# EAGLE board dw8e (EAGLE 6.6.0)
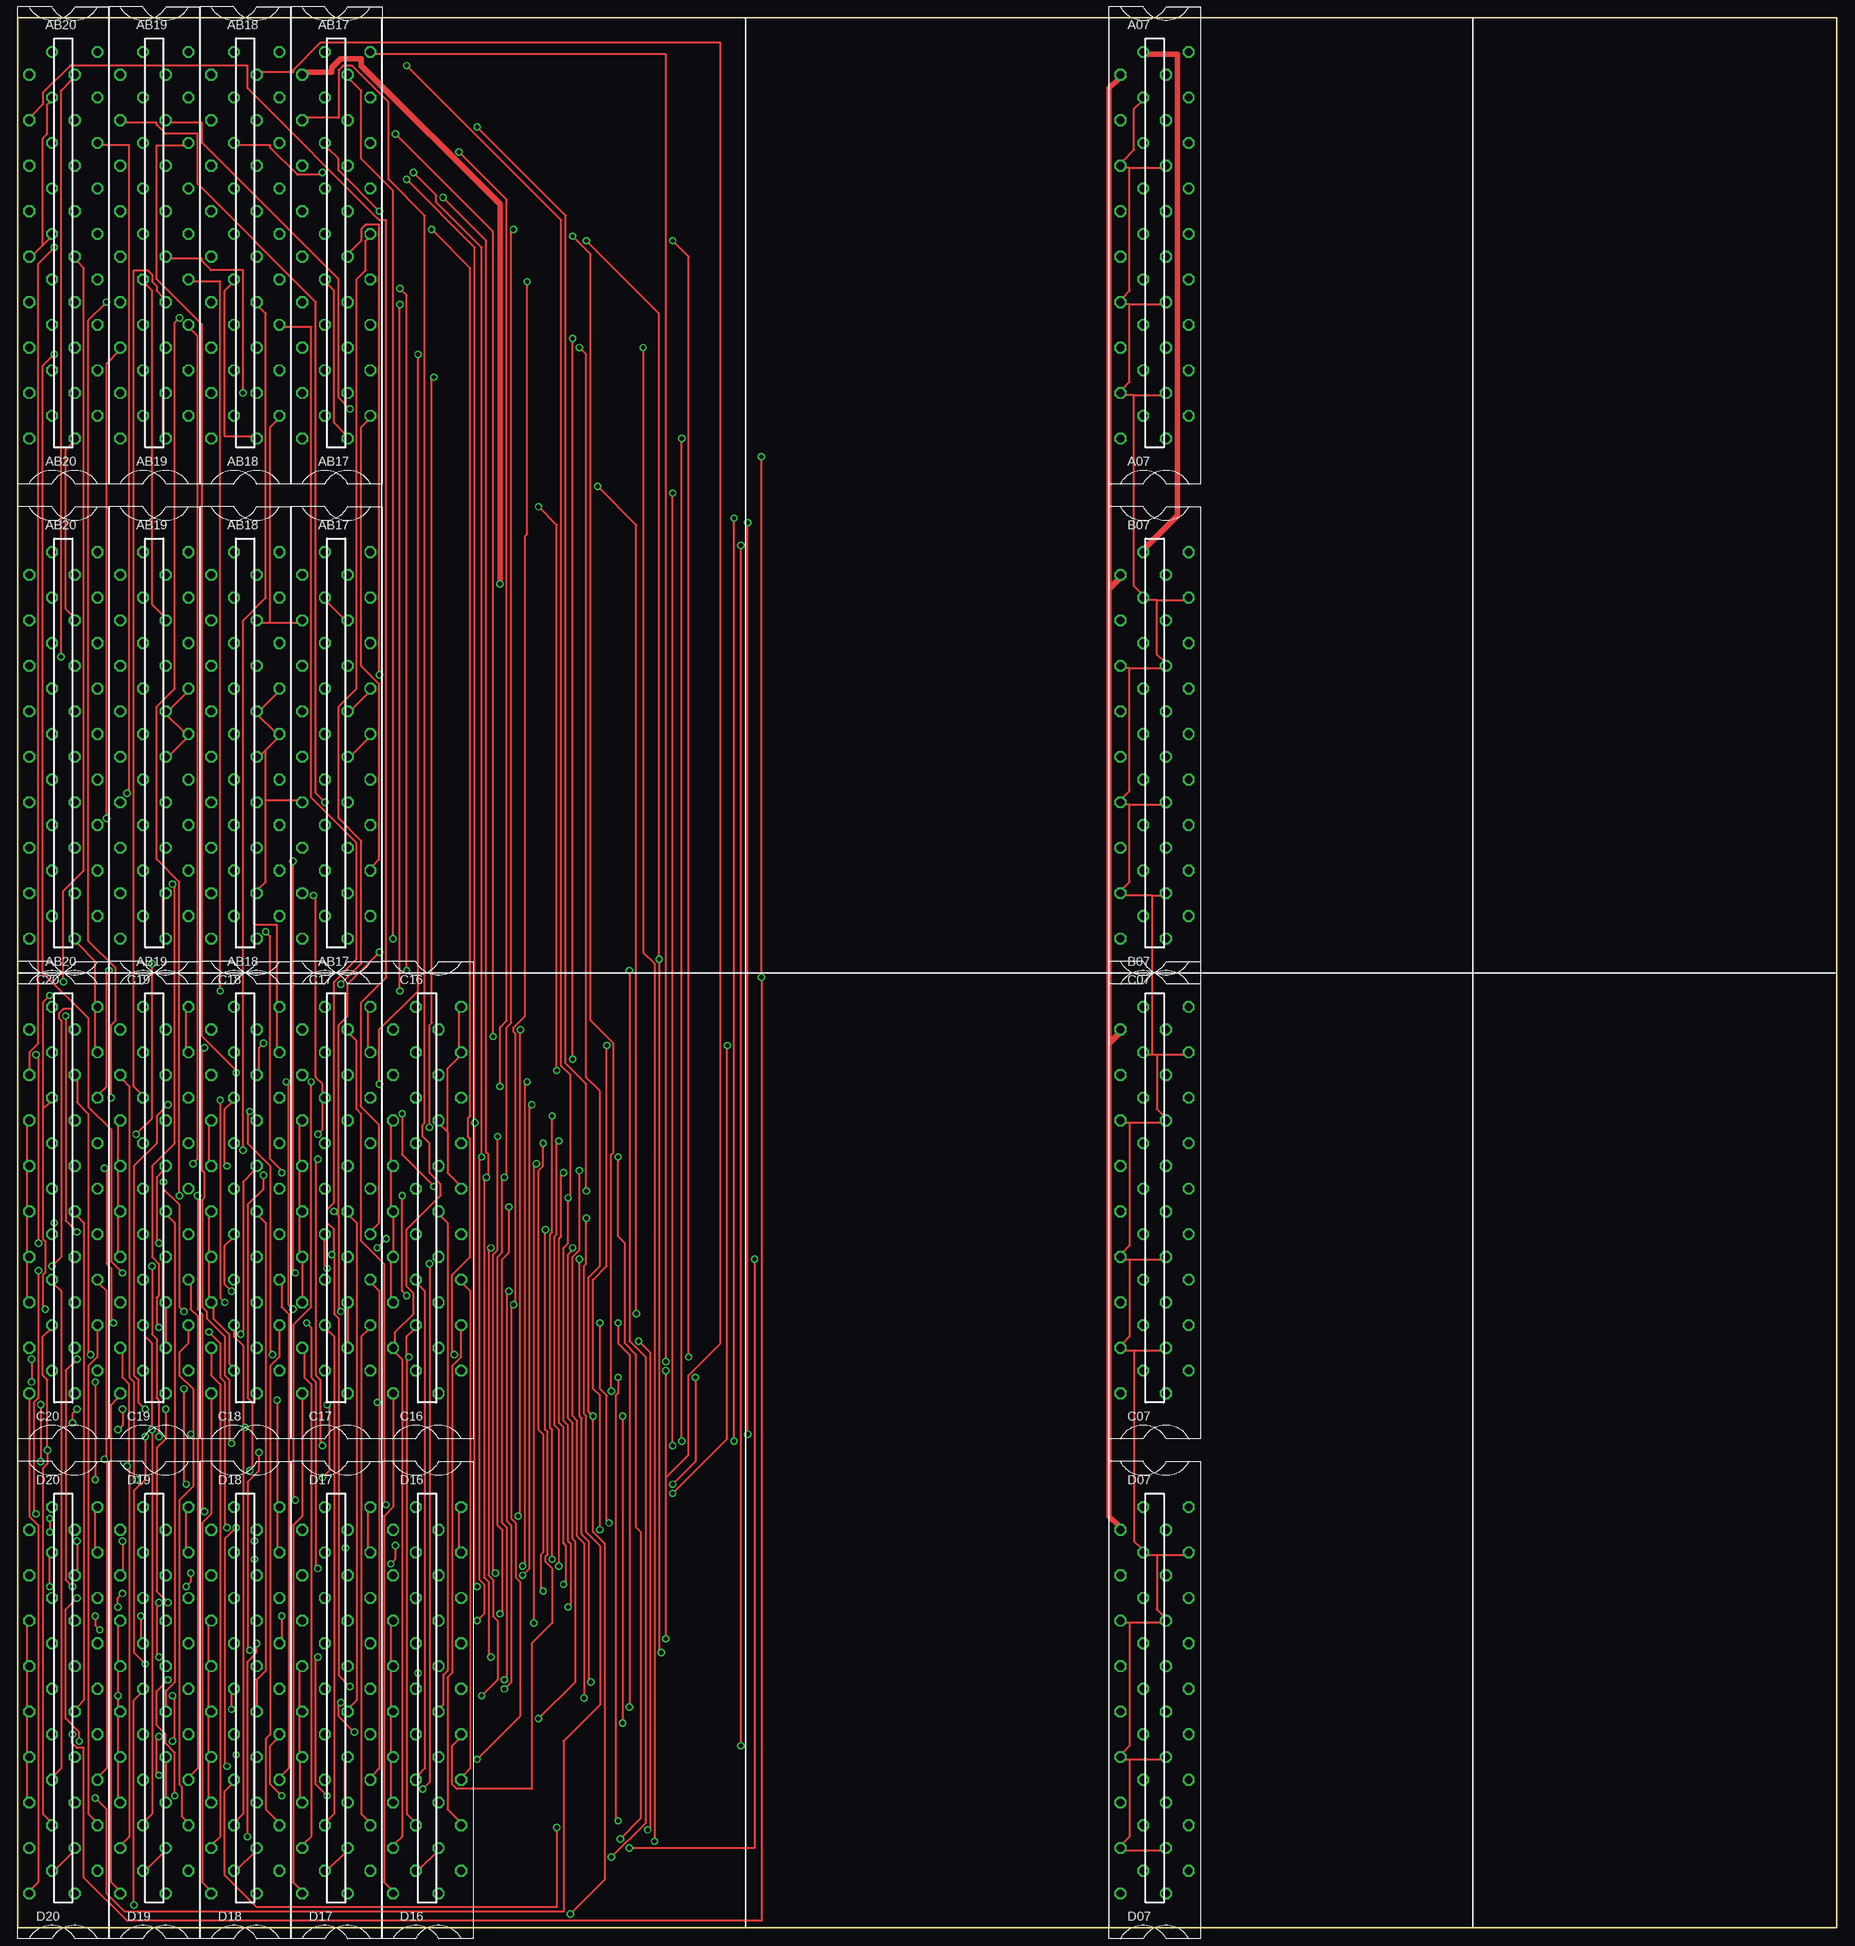
[diagram p10: board, top side]
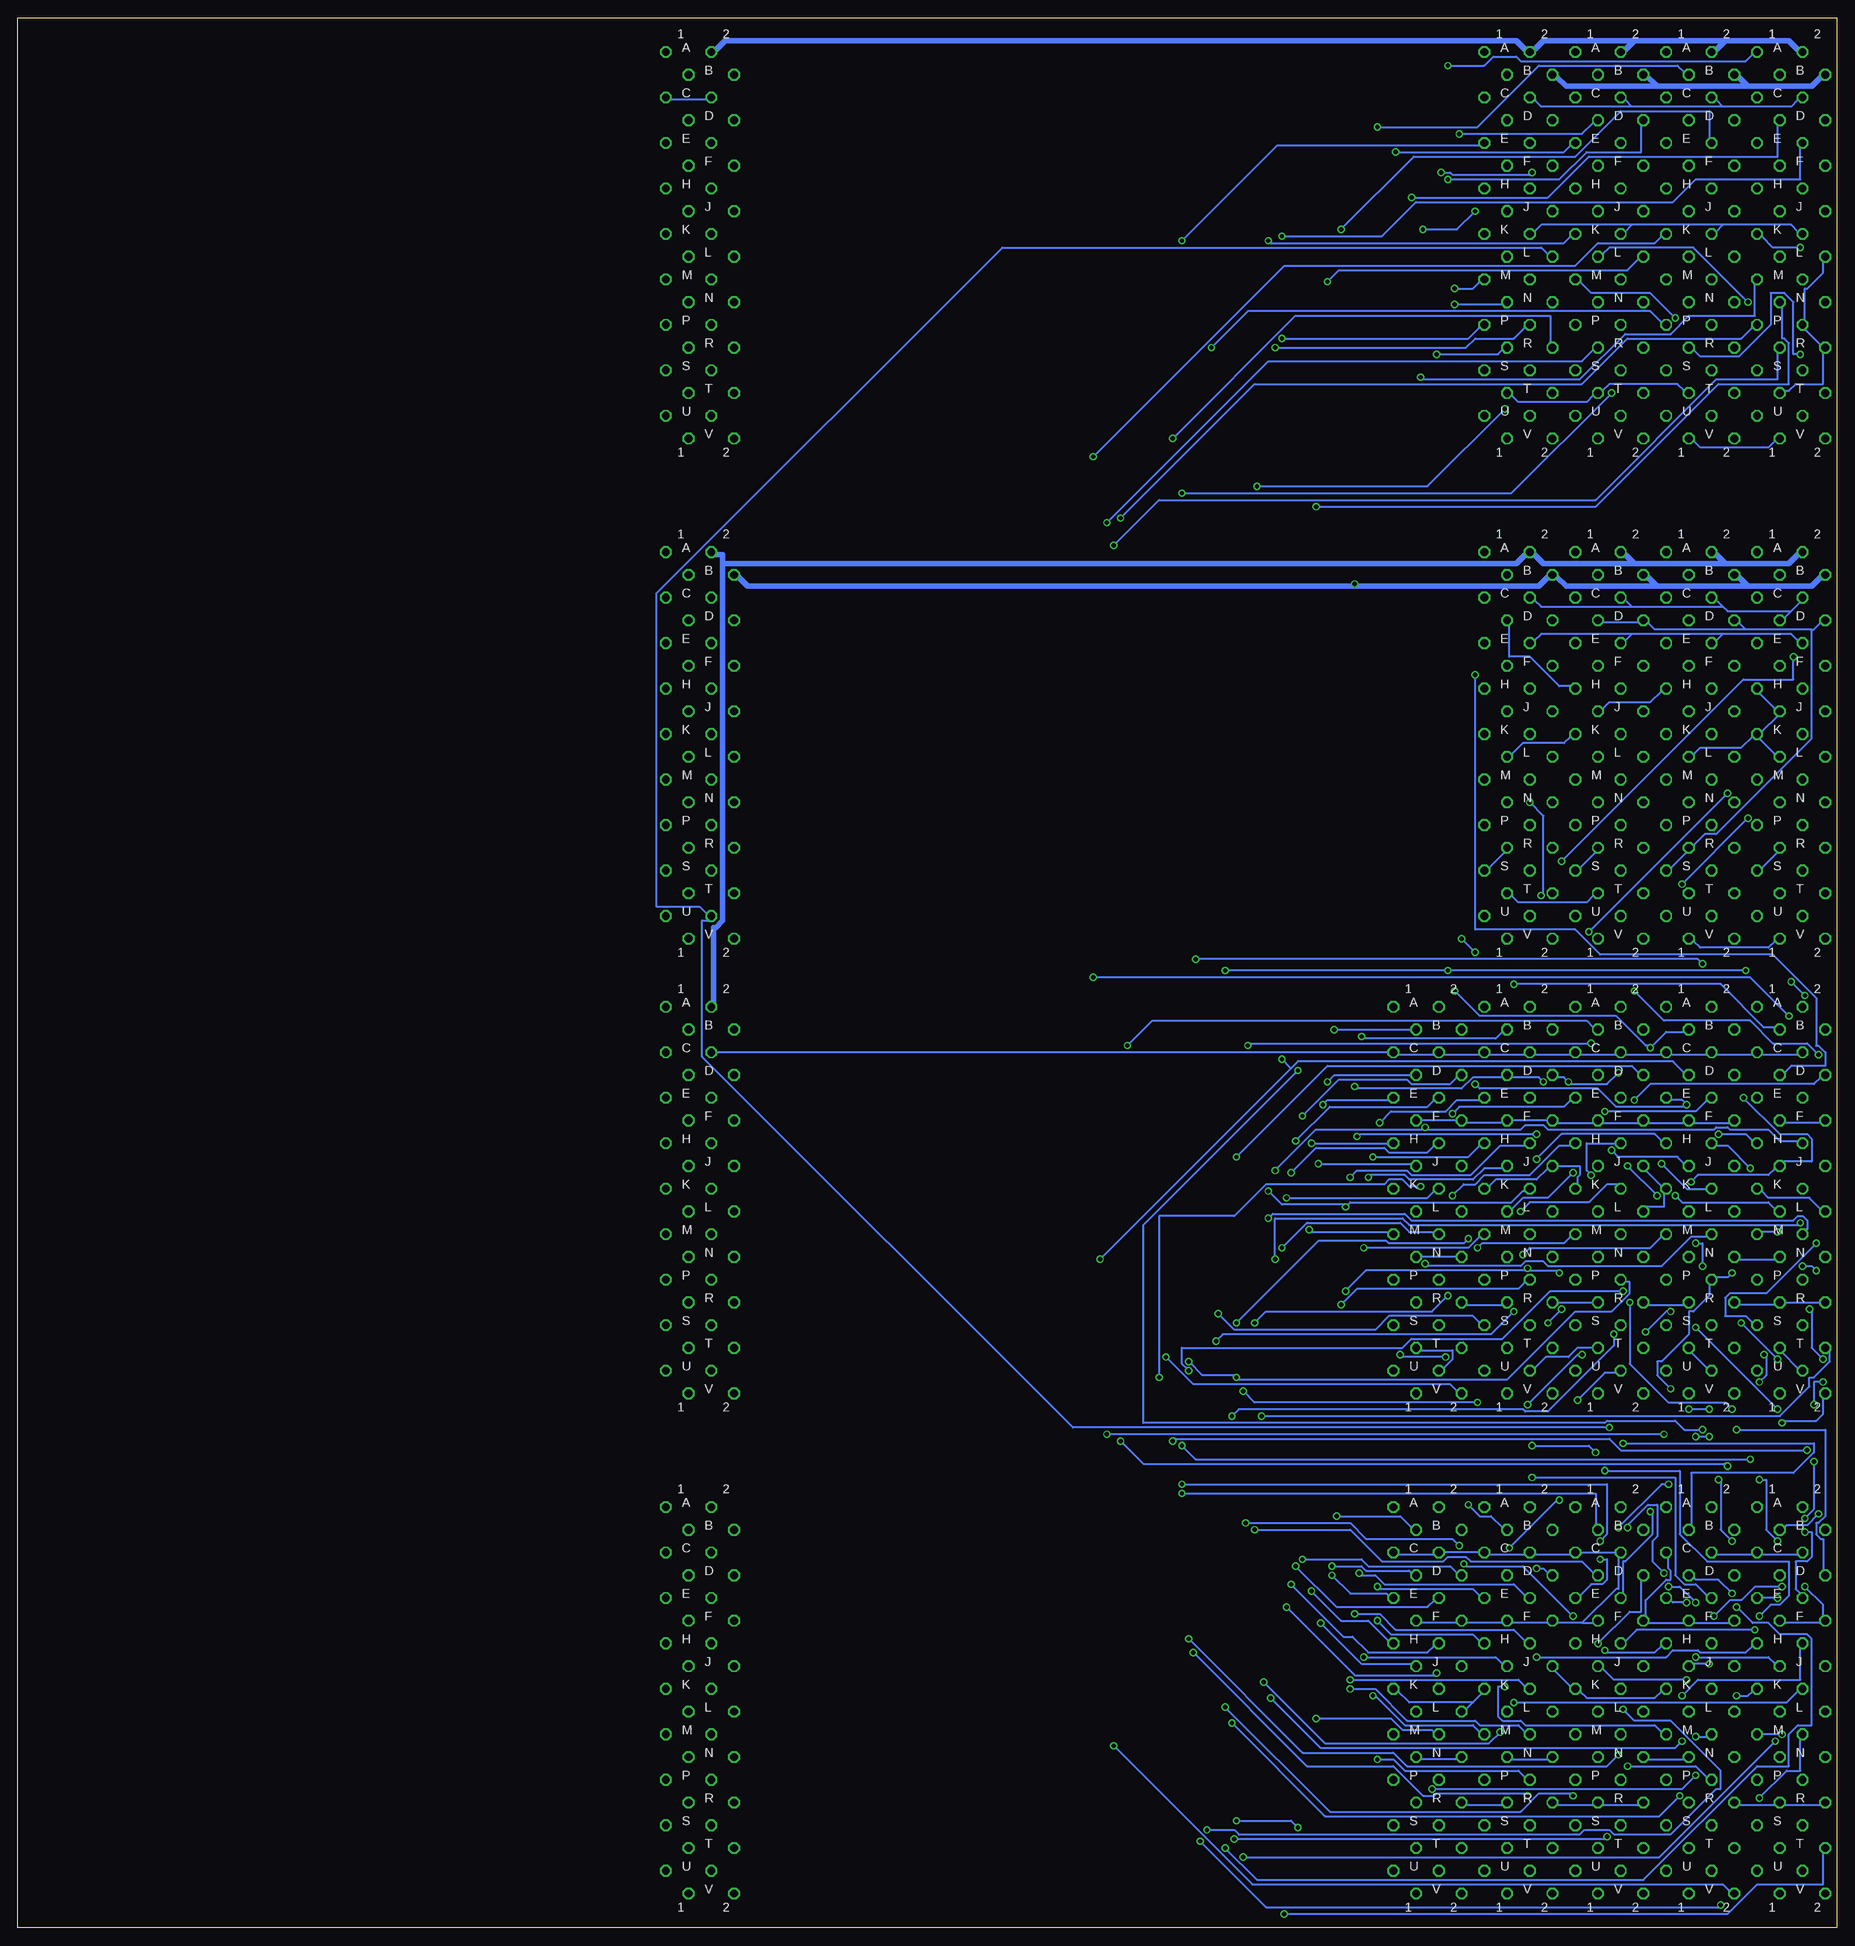
[diagram p11: board, bottom side, seen from below]

Size 254 x 266.7 mm. Coordinates in mm from the lower left corner, seen from the top.
Outline: 0,0 254,0 254,266.7 0,266.7 0,0
Copper layers (1*16): Top 0.035mm / dielectric 1.5mm / Bottom 0.035mm
Design rules "default": minimum track width 10mil, minimum drill 24mil, track to track 8mil, track to pad 8mil, pad to pad 8mil, via to via 8mil, smd to smd 8mil, copper to edge 25mil, drill to drill 8mil, minimum pad ring 10mil, minimum via ring 8mil, stop-mask expansion 4mil, vias tented up to drill 0mil, thermal gap 10mil
Net classes: 1 Supply: width 0.762 mm

## Footprints (pad centres in the part's own frame; a part is rotated, then mirrored left to right if it is on the bottom)
H807 = drill 1.092 octagon: A1 4.763,28.575; A2 -1.587,28.575; B1 1.587,25.4; B2 -4.763,25.4; C1 4.763,22.225; C2 -1.587,22.225; D1 1.587,19.05; D2 -4.763,19.05; E1 4.763,15.875; E2 -1.587,15.875; F1 1.587,12.7; F2 -4.763,12.7; H1 4.763,9.525; H2 -1.587,9.525; J1 1.587,6.35; J2 -4.763,6.35; K1 4.763,3.175; K2 -1.587,3.175; L1 1.587,0; L2 -4.763,0; M1 4.763,-3.175; M2 -1.587,-3.175; N1 1.587,-6.35; N2 -4.763,-6.35; P1 4.763,-9.525; P2 -1.587,-9.525; R1 1.587,-12.7; R2 -4.763,-12.7; S1 4.763,-15.875; S2 -1.587,-15.875; T1 1.587,-19.05; T2 -4.763,-19.05; U1 4.763,-22.225; U2 -1.587,-22.225; V1 1.587,-25.4; V2 -4.763,-25.4
H807-2 = drill 1.092 octagon: AA1 4.763,60.325; AA2 -1.587,60.325; AB1 1.587,57.15; AB2 -4.763,57.15; AC1 4.763,53.975; AC2 -1.587,53.975; AD1 1.587,50.8; AD2 -4.763,50.8; AE1 4.763,47.625; AE2 -1.587,47.625; AF1 1.587,44.45; AF2 -4.763,44.45; AH1 4.763,41.275; AH2 -1.587,41.275; AJ1 1.587,38.1; AJ2 -4.763,38.1; AK1 4.763,34.925; AK2 -1.587,34.925; AL1 1.587,31.75; AL2 -4.763,31.75; AM1 4.763,28.575; AM2 -1.587,28.575; AN1 1.587,25.4; AN2 -4.763,25.4; AP1 4.763,22.225; AP2 -1.587,22.225; AR1 1.587,19.05; AR2 -4.763,19.05; AS1 4.763,15.875; AS2 -1.587,15.875; AT1 1.587,12.7; AT2 -4.763,12.7; AU1 4.763,9.525; AU2 -1.587,9.525; AV1 1.587,6.35; AV2 -4.763,6.35; BA1 4.763,-9.525; BA2 -1.587,-9.525; BB1 1.587,-12.7; BB2 -4.763,-12.7; BC1 4.763,-15.875; BC2 -1.587,-15.875; BD1 1.587,-19.05; BD2 -4.763,-19.05; BE1 4.763,-22.225; BE2 -1.587,-22.225; BF1 1.587,-25.4; BF2 -4.763,-25.4; BH1 4.763,-28.575; BH2 -1.587,-28.575; BJ1 1.587,-31.75; BJ2 -4.763,-31.75; BK1 4.763,-34.925; BK2 -1.587,-34.925; BL1 1.587,-38.1; BL2 -4.763,-38.1; BM1 4.763,-41.275; BM2 -1.587,-41.275; BN1 1.587,-44.45; BN2 -4.763,-44.45; BP1 4.763,-47.625; BP2 -1.587,-47.625; BR1 1.587,-50.8; BR2 -4.763,-50.8; BS1 4.763,-53.975; BS2 -1.587,-53.975; BT1 1.587,-57.15; BT2 -4.763,-57.15; BU1 4.763,-60.325; BU2 -1.587,-60.325; BV1 1.587,-63.5; BV2 -4.763,-63.5

## Placement (x,y rotation side)
A07  M916  [H807]  158.75,233.36 0 top
AB17  M7102  [H807-2]  44.45,201.61 0 top
AB18  M7102  [H807-2]  31.75,201.61 0 top
AB19  M7102  [H807-2]  19.05,201.61 0 top
AB20  M7102  [H807-2]  6.35,201.61 0 top
B07  M916  [H807]  158.75,163.51 0 top
C07  M916  [H807]  158.75,100.01 0 top
C16  M903  [H807]  57.15,100.01 0 top
C17  M903  [H807]  44.45,100.01 0 top
C18  M903  [H807]  31.75,100.01 0 top
C19  M903  [H807]  19.05,100.01 0 top
C20  M903  [H807]  6.35,100.01 0 top
D07  M916  [H807]  158.75,30.16 0 top
D16  M903  [H807]  57.15,30.16 0 top
D17  M903  [H807]  44.45,30.16 0 top
D18  M903  [H807]  31.75,30.16 0 top
D19  M903  [H807]  19.05,30.16 0 top
D20  M903  [H807]  6.35,30.16 0 top
U$1  [CBLOCK]  152.4,133.35 0 top
U$2  [CBLOCK]  101.6,133.35 0 top
U$3  [CBLOCK]  50.8,133.35 0 top
U$4  [CBLOCK]  0,133.35 0 top
U$6  [CBLOCK]  0,0 0 top
U$7  [CBLOCK]  50.8,0 0 top
U$8  [CBLOCK]  101.6,0 0 top
U$9  [CBLOCK]  152.4,0 0 top
U$10  [CBLOCK]  203.2,0 0 top
U$11  [CBLOCK]  203.2,0 0 top
U$12  [CBLOCK]  203.2,133.35 0 top

## Tracks (layer width: path | path; a pad name or v marks a point on that pad's centre or on a via)
-15V  (via drill 0.61)
  Top 0.762: 152.4,123.51 152.4,57.47 153.67,56.2 D07.B2 | 152.4,123.51 153.67,124.78 C07.B2 | 152.56,187.17 152.4,187.01 152.4,123.82 152.4,123.51 | 152.56,187.17 153.67,188.28 B07.B2 | A07.B2 153.67,258.13 152.4,256.86 152.4,187.32 152.56,187.17 | v67.31,187.64 67.31,240.66 47.94,260.03 47.94,260.99 45.09,260.99 43.81,259.71 43.81,259.08 40.32,259.08 AB17.AB2
  Bottom 0.762: 12.38,257.18 3.49,257.18 2.22,258.44 AB20.AB2 | 12.38,257.18 13.65,258.44 AB19.AB2 | 25.24,257.33 25.08,257.18 12.7,257.18 12.38,257.18 | 25.24,257.33 26.35,258.44 AB18.AB2 | AB17.AB2 39.05,258.44 37.78,257.18 25.4,257.18 25.24,257.33 | 12.38,187.32 3.49,187.32 2.22,188.59 AB20.BB2 | 12.38,187.32 13.65,188.59 AB19.BB2 | 25.24,187.48 25.08,187.32 12.7,187.32 12.38,187.32 | 25.24,187.48 26.35,188.59 AB18.BB2 | 25.24,187.48 25.4,187.32 37.78,187.32 39.05,188.59 AB17.BB2 40.32,188.59 41.59,187.32 67.31,187.32 | 67.31,187.32 152.08,187.32 153.35,188.59 B07.B2 | 67.31,187.32 v67.31,187.64
AC_00_BUS_L  (via drill 0.61)
  Top 0.254: v91.44,60.64 99.06,68.26 v99.06,123.19
  Bottom 0.254: v91.44,60.64 33.66,60.64 33.66,56.2 D18.B1 | v99.06,123.19 95.57,126.68 34.92,126.68 33.97,125.73 C18.B1
AC_01_BUS_L  (via drill 0.61)
  Top 0.254: v81.28,55.56 81.28,74.29 80.33,75.25 80.33,90.49 82.23,92.39 v82.23,123.19 | v34.29,123.51 33.66,122.87 33.66,119.7 C18.D1
  Bottom 0.254: v81.28,55.56 67.94,55.56 63.5,51.12 54.93,51.12 54.29,51.75 51.75,51.75 51.12,51.12 35.56,51.12 33.97,49.53 D18.D1 | v82.23,123.19 81.92,123.51 v34.29,123.51
AC_02_BUS_L  (via drill 0.61)
  Top 0.254: v33.02,53.97 v33.02,51.43 | v91.44,61.91 94.61,65.09 v94.61,76.83 | v58.1,103.5 53.66,107.95 v53.66,113.66
  Bottom 0.254: v33.02,51.43 32.07,51.43 32.07,48.58 32.7,47.94 34.29,47.94 35.88,46.35 D18.E1 | v33.02,53.97 32.07,54.93 32.07,61.91 v91.44,61.91 | v94.61,76.83 94.61,99.38 84.14,99.38 79.69,103.82 63.18,103.82 62.55,104.46 60.64,104.46 59.69,103.5 v58.1,103.5 | v53.66,113.66 52.7,114.62 38.1,114.62 37.15,115.57 C18.E1
AC_03_BUS_L  (via drill 0.61)
  Top 0.254: v36.83,43.5 36.83,40.32 D18.H1 | v52.07,50.8 52.7,51.43 v52.7,53.34 | v82.55,56.52 82.23,56.83 82.23,74.29 81.28,75.25 v81.28,84.45 | v54.29,88.26 53.66,88.9 v53.66,102.23
  Bottom 0.254: v36.83,43.5 43.81,50.48 51.75,50.48 v52.07,50.8 | v52.7,53.34 53.66,54.29 65.72,54.29 67.94,56.52 v82.55,56.52 | v81.28,84.45 79.69,86.04 56.52,86.04 v54.29,88.26 | v53.66,102.23 52.07,103.82 50.48,103.82 49.21,105.09 42.86,105.09 38.73,109.22 37.15,109.22 C18.H1
AC_04_BUS_L  (via drill 0.61)
  Top 0.254: v20.95,34.61 19.37,33.02 19.37,28.26 20.64,26.99 20.64,25.72 21.91,24.45 v21.91,18.41 | v84.45,71.44 v84.45,28.57 | v31.11,82.87 31.43,83.19 31.43,104.14 33.02,105.73 C18.J1
  Bottom 0.254: v20.95,34.61 31.11,34.61 32.7,36.19 D18.J1 | v21.91,18.41 24.77,15.56 71.44,15.56 v84.45,28.57 | v84.45,71.44 83.5,72.39 43.81,72.39 43.5,72.07 40.32,72.07 31.11,81.28 v31.11,82.87
AC_05_BUS_L
  Top 0.254: D18.L1 33.34,30.8 33.34,34.61 34.61,35.88 34.61,98.42 33.66,99.38 C18.L1
AC_06_BUS_L  (via drill 0.61)
  Top 0.254: v36.83,18.41 35.24,20 35.24,25.4 36.2,26.35 D18.M1 | v85.41,30.8 85.41,80.01 83.82,81.6 v83.82,84.45 | v50.16,94.93 v51.44,96.2
  Bottom 0.254: v36.83,18.41 37.15,18.73 41.59,18.73 44.13,16.19 70.8,16.19 v85.41,30.8 | v83.82,84.45 72.39,95.88 62.87,95.88 62.55,95.57 52.07,95.57 v51.44,96.2 | v50.16,94.93 49.53,95.57 38.1,95.57 37.15,96.52 C18.M1
AC_07_BUS_L
  Top 0.254: D18.P1 36.83,21.27 37.78,22.22 37.78,85.72 36.83,86.68 36.83,89.85 C18.P1
AC_08_BUS_L
  Top 0.254: D18.S1 36.2,14.92 34.61,16.51 34.61,26.35 35.24,26.99 35.24,78.42 36.51,79.69 36.51,83.5 C18.S1
AC_09_BUS_L  (via drill 0.61)
  Top 0.254: v33.34,39.69 33.34,38.42 32.07,37.15 v32.07,12.7 | v84.14,12.38 87,15.24 87,55.24 86.36,55.88 86.36,80.01 84.77,81.6 84.77,95.57 83.82,96.52 v83.82,107.63
  Bottom 0.254: v33.34,39.69 28.89,44.13 27.3,44.13 27.3,48.58 D18.D2 | v32.07,12.7 32.38,12.38 v84.14,12.38 | v83.82,107.63 71.12,120.33 28.57,120.33 27.62,119.38 C18.D2
AC_10_BUS_L  (via drill 0.61)
  Top 0.254: v26.04,58.1 25.72,58.42 25.72,85.72 25.08,86.36 v25.08,102.23 | v29.21,106.36 28.89,106.68 28.89,114.3 29.84,115.25 C18.E2
  Bottom 0.254: v26.04,58.1 25.72,58.1 25.72,54.93 29.53,51.12 29.84,51.12 29.84,46.67 D18.E2 | v29.21,106.36 v25.08,102.23
AC_11_BUS_L  (via drill 0.61)
  Top 0.254: v11.43,41.59 10.79,42.23 v10.79,43.5 | v32.38,63.82 32.7,64.13 32.7,73.34 32.07,73.98 32.07,100.97 34.29,103.19 v34.29,105.09
  Bottom 0.254: v11.43,41.59 27.94,41.59 29.53,40 D18.H2 | v10.79,43.5 9.21,45.08 7.94,45.08 6.67,46.35 6.67,51.12 18.1,51.12 21.91,54.93 21.91,63.82 v32.38,63.82 | v34.29,105.09 34.92,105.73 34.92,109.54 30.8,109.54 C18.H2
AC_CLEAR_BUS_L  (via drill 0.61)
  Top 0.254: v75.25,13.97 75.25,2.86 33.34,2.86 28.89,7.3 28.89,19.05 29.84,20 D18.P2 | v83.82,14.92 83.5,15.24 83.5,74.29 83.82,74.61 v83.82,76.83 | v90.49,79.06 90.49,261.62 49.85,261.62 AB17.AA1
  Bottom 0.254: v75.25,13.97 76.2,14.92 v83.82,14.92 | C18.P2 29.53,90.17 28.89,90.17 28.89,88.58 31.43,86.04 36.51,86.04 46.04,76.52 83.5,76.52 v83.82,76.83 84.14,77.15 88.58,77.15 v90.49,79.06
B_C1
  Bottom 0.254: 15.88,180.66 6.35,180.66 5.4,179.7 AB20.BE2 | 15.88,180.66 16.83,179.7 AB19.BE2 | 28.57,180.66 29.53,179.7 AB18.BE2 | 15.88,180.66 28.57,180.66 | 28.57,180.66 41.27,180.66 42.23,179.7 AB17.BE2
B_INITIALIZE  (via drill 0.61)
  Top 0.254: D20.V2 1.91,5.4 2.86,6.35 2.86,56.2 1.59,57.47 1.59,73.98 C20.V2 | v12.38,154.94 12.38,218.44 13.97,220.03 AB19.AR2 | v21.59,145.73 21.91,145.41 21.91,109.54 18.73,106.36 18.73,93.66 19.68,92.71 19.68,88.26 19.37,87.95 19.37,84.14 v19.68,83.82 | v8.26,72.39 7.62,71.75 v7.62,70.48
  Bottom 0.254: v21.59,145.73 v12.38,154.94 | v19.68,83.82 v8.26,72.39 | v7.62,70.48 7.3,70.8 2.86,70.8 1.91,71.75 1.91,73.98 C20.V2
B_RUN_L  (via drill 0.61)
  Top 0.254: 31.43,69.85 31.43,81.28 30.16,82.55 30.16,83.5 C18.S2 | 31.43,69.85 31.43,15.88 30.48,14.92 D18.S2 | 31.43,69.85 v31.75,69.85
  Bottom 0.254: AB17.AL2 40.32,233.68 41.27,234.63 116.52,234.63 164.78,186.37 164.78,142.56 158.75,142.56 157.8,141.6 B07.U2 157.48,140.65 158.43,140.65 158.43,121.6 106.68,69.85 v31.75,69.85
B_TT_INST
  Top 0.254: D18.T2 27.3,11.75 28.26,12.7 28.26,75.88 26.99,77.15 26.99,80.33 C18.T2
BAC_00  (via drill 0.61)
  Top 0.254: v2.54,57.78 2.22,58.1 2.22,73.34 2.86,73.98 v2.86,91.76 | v4.76,92.39 6.03,93.66 6.03,126.68 5.71,127 5.71,127.63 6.35,128.27 7.62,128.27 7.62,126.05 C20.B1 | v45.09,131.76 47.94,134.62 47.94,151.76 44.77,154.94 44.77,170.5 47.31,173.04 47.31,230.19 48.58,231.46 48.58,235.58 48.9,235.9 AB17.AK1
  Bottom 0.254: v2.54,57.78 4.13,56.2 6.99,56.2 7.3,55.88 D20.B1 | v2.86,91.76 3.49,92.39 v4.76,92.39 | v45.09,131.76 16.19,131.76 10.16,125.73 8.57,125.73 C20.B1
BAC_01  (via drill 0.61)
  Top 0.254: v8.26,53.97 8.26,49.85 D20.D1 | v10.79,76.2 v10.79,62.55 | v10.16,80.01 9.84,80.33 9.84,113.66 8.26,115.25 8.26,118.43 C20.D1 | v50.48,174.94 50.48,237.81 48.58,237.81 47.94,237.17 47.94,235.58 46.35,234 AB17.AL1
  Bottom 0.254: v8.26,53.97 9.84,55.56 9.84,62.55 v10.79,62.55 | v10.79,76.2 9.84,77.15 9.84,80.01 v10.16,80.01 | v50.48,174.94 50.48,139.38 36.51,139.38 33.02,135.89 8.89,135.89 2.86,129.86 2.86,123.19 2.54,123.19 1.59,122.24 1.59,120.33 6.35,120.33 7.3,119.38 C20.D1
BAC_02  (via drill 0.61)
  Top 0.254: v8.26,46.04 6.67,44.45 6.67,29.21 8.57,27.3 v8.57,26.03 | v82.87,9.84 87.63,14.6 87.63,79.69 85.41,81.91 v85.41,133.67 | v12.7,133.67 12.38,133.35 12.38,117.47 11.43,116.52 C20.E1 | v53.34,228.92 54.29,227.96 v54.29,133.67
  Bottom 0.254: v8.26,46.04 10.48,46.04 D20.E1 | v8.57,26.03 24.77,9.84 v82.87,9.84 | v12.7,133.67 v54.29,133.67 v85.41,133.67 | v53.34,228.92 50.8,228.92 49.85,229.87 AB17.AM1
BAC_03  (via drill 0.61)
  Top 0.254: v41.91,37.78 41.59,37.46 41.59,20 v43.18,18.41 | v89.85,38.42 89.53,38.73 v89.53,135.25 89.53,225.43 v79.38,235.58 | v16.51,110.81 18.73,113.03 v18.73,134.62
  Bottom 0.254: v41.91,37.78 23.81,37.78 22.86,38.73 19.37,38.73 19.05,38.42 12.7,38.42 11.75,39.37 D20.H1 | v43.18,18.41 43.5,18.73 55.88,18.73 56.2,18.41 57.78,18.41 61.91,22.54 73.98,22.54 v89.85,38.42 | v79.38,235.58 79.06,235.27 38.1,235.27 37.15,236.22 AB18.AK1 | v16.51,110.81 12.7,110.81 11.75,109.85 C20.H1 | v18.73,134.62 19.37,135.25 v89.53,135.25
BAC_04  (via drill 0.61)
  Top 0.254: v19.68,37.78 19.37,38.1 19.37,45.08 v19.68,45.4 | v23.5,47.62 24.13,48.26 v24.13,49.53 | v29.21,55.88 28.89,56.2 28.89,76.2 28.26,76.83 28.26,81.6 v26.67,83.19 | v23.18,86.04 22.54,86.68 22.54,100.97 20.32,103.19 v20.32,104.14 | v12.38,227.01 9.84,224.47 9.84,137.79 13.65,133.98 13.65,126.68 13.02,126.05 v13.02,115.89
  Bottom 0.254: v19.68,37.78 9.53,37.78 8.57,36.83 D20.J1 | v19.68,45.4 21.91,47.62 v23.5,47.62 | v24.13,49.53 25.72,51.12 25.72,53.97 25.08,54.61 25.08,59.05 26.35,59.05 29.21,56.2 v29.21,55.88 | v26.67,83.19 23.81,86.04 v23.18,86.04 | v20.32,104.14 19.37,105.09 9.53,105.09 8.57,106.04 C20.J1 7.62,107 3.49,107 3.49,110.17 4.13,110.81 7.94,110.81 v13.02,115.89 | v12.38,227.01 20,234.63 31.75,234.63 32.7,233.68 AB18.AL1
BAC_05  (via drill 0.61)
  Top 0.254: D20.L1 8.26,30.8 9.21,31.75 9.21,98.42 8.26,99.38 C20.L1 | v22.54,224.79 21.91,224.16 21.91,173.04 19.37,170.5 19.37,149.22 22.54,146.05 v22.54,102.23
  Bottom 0.254: v22.54,224.79 26.04,228.28 34.29,228.28 35.88,229.87 AB18.AM1 | v22.54,102.23 21.59,101.28 9.53,101.28 8.57,100.33 C20.L1
BAC_06  (via drill 0.61)
  Top 0.254: v7.62,26.99 7.62,25.72 8.26,25.08 9.21,25.08 9.21,6.98 15.24,0.95 103.82,0.95 v103.82,132.72 v103.82,205.42 | v8.26,97.16 6.67,98.74 v6.67,127.32
  Bottom 0.254: v7.62,26.99 10.48,26.99 D20.M1 | v103.82,205.42 77.15,232.09 36.51,232.09 33.34,235.27 25.4,235.27 24.45,236.22 AB19.AK1 | v8.26,97.16 10.48,97.16 C20.M1 | v6.67,127.32 12.06,132.72 v103.82,132.72
BAC_07  (via drill 0.61)
  Top 0.254: 12.38,65.41 12.38,88.9 11.43,89.85 C20.P1 | 12.38,65.41 12.38,22.22 11.43,21.27 D20.P1 | v31.43,214.31 31.43,231.46 26.99,231.46 25.72,232.73 25.72,233.04 21.27,233.04 AB19.AL1 | v91.44,67.31 v91.44,200.34 | v12.06,65.41 12.38,65.41
  Bottom 0.254: v31.43,214.31 45.4,200.34 v91.44,200.34 | v91.44,67.31 89.53,65.41 v12.06,65.41
BAC_08  (via drill 0.61)
  Top 0.254: D20.S1 10.79,14.92 9.84,15.88 9.84,78.42 11.11,79.69 11.11,83.5 C20.S1 | v28.26,130.81 28.26,229.87 24.45,229.87 AB19.AM1 | v2.54,121.92 2.86,121.6 v2.86,95.57
  Bottom 0.254: v28.26,130.81 24.13,126.68 12.06,126.68 8.89,123.51 4.13,123.51 v2.54,121.92 | v2.86,95.57 9.84,88.58 14.92,88.58 15.56,87.95 15.56,85.41 12.7,85.41 11.75,84.45 C20.S1
BAC_09  (via drill 0.61)
  Top 0.254: v13.97,69.53 14.61,70.17 v14.61,72.39 | v28.89,87.31 28.26,87.95 v28.26,115.57 | v5.08,234.63 2.86,232.41 2.86,123.51 1.59,122.24 1.59,119.7 C20.D2
  Bottom 0.254: v13.97,69.53 1.59,69.53 1.59,57.47 2.54,56.52 2.86,56.52 2.86,54.93 2.22,54.29 1.91,54.29 1.91,49.85 D20.D2 | v14.61,72.39 15.56,73.34 23.5,73.34 28.89,78.74 v28.89,87.31 | v28.26,115.57 26.04,117.79 3.17,117.79 2.22,118.74 C20.D2 | v5.08,234.63 8.89,234.63 10.48,236.22 AB20.AK1
BAC_10  (via drill 0.61)
  Top 0.254: v4.45,57.15 v4.45,55.24 | v3.17,73.02 v3.17,65.09 | v1.91,79.38 v1.91,76.2 | v3.81,86.36 3.49,86.68 3.49,91.12 3.81,91.44 3.81,95.88 3.49,96.2 3.49,114.3 | 3.49,114.3 4.45,115.25 C20.E2 | v6.35,132.08 6.35,144.78 9.21,147.64 9.21,231.77 8.26,232.73 AB20.AL1 | v4.45,130.17 3.49,129.22 3.49,114.3
  Bottom 0.254: v4.45,55.24 3.49,55.24 3.49,51.75 4.13,51.12 5.71,51.12 5.71,47.31 5.08,46.67 D20.E2 | v4.45,57.15 3.17,58.42 v3.17,65.09 | v3.17,73.02 3.17,76.2 v1.91,76.2 | v1.91,79.38 3.49,80.96 3.49,86.36 v3.81,86.36 | v4.45,130.17 v6.35,132.08
BAC_11  (via drill 0.61)
  Top 0.254: v21.59,32.38 21.91,32.07 21.91,26.35 v21.59,26.03 | v79.06,32.07 79.06,53.66 78.11,54.61 78.11,70.8 77.47,71.44 77.47,93.66 78.42,94.61 v78.42,105.73 | v58.1,216.53 57.78,216.22 57.78,126.36 57.47,126.05 v57.47,111.76
  Bottom 0.254: v21.59,32.38 19.37,34.61 5.08,34.61 5.08,39.05 D20.H2 | v21.59,26.03 22.54,25.08 72.07,25.08 v79.06,32.07 | v78.42,105.73 72.71,111.44 57.47,111.44 | 57.47,111.44 44.13,111.44 43.5,112.08 40.96,112.08 40.32,111.44 17.14,111.44 16.83,111.76 15.24,111.76 14.92,111.44 9.53,111.44 7.94,109.85 5.4,109.85 C20.H2 | v58.1,216.53 57.78,216.22 35.88,216.22 29.53,222.57 23.18,222.57 20.64,225.11 11.43,225.11 11.43,229.55 AB20.AM1 | 57.47,111.44 v57.47,111.76
BIOP1  (via drill 0.61)
  Top 0.254: v45.09,31.43 44.77,31.11 44.77,29.53 v46.99,27.3 | v80.01,34.29 79.69,34.61 79.69,53.97 78.74,54.93 78.74,71.12 78.42,71.44 v78.42,93.34 | v5.08,98.42 5.08,102.55 C20.K2
  Bottom 0.254: v45.09,31.43 6.99,31.43 5.4,33.02 D20.K2 | v46.99,27.3 48.58,25.72 71.44,25.72 v80.01,34.29 | v78.42,93.34 78.42,99.06 60.64,99.06 59.69,98.11 5.4,98.11 v5.08,98.42
BIOP2  (via drill 0.61)
  Top 0.254: v10.79,18.1 12.38,16.51 12.38,4.76 14.92,2.22 76.2,2.22 76.2,26.03 81.28,31.11 81.28,53.34 79.38,55.24 79.38,71.44 79.06,71.75 79.06,92.39 79.38,92.71 v79.38,99.06
  Bottom 0.254: v10.79,18.1 6.99,21.91 5.08,21.91 5.08,26.35 D20.M2 | v79.38,99.06 78.74,99.69 60.33,99.69 59.37,98.74 6.03,98.74 5.4,99.38 4.76,99.38 4.13,98.74 4.13,97.47 4.45,97.47 C20.M2
BIOP4
  Top 0.254: D20.P2 5.08,21.27 6.03,22.22 6.03,88.9 5.08,89.85 C20.P2
BMB_00  (via drill 0.61)
  Top 0.254: v29.84,67.63 29.53,67.94 29.53,76.52 28.89,77.15 28.89,82.55 26.35,85.09 26.35,86.04 25.72,86.68 25.72,101.6 26.04,101.92 26.04,105.41 25.72,105.73 25.72,122.55 v26.04,122.87 | v53.34,130.81 v53.34,226.69
  Bottom 0.254: v29.84,67.63 3.17,67.63 3.17,66.36 6.03,63.5 20.32,63.5 20.32,56.2 D19.B1 | C19.B1 21.27,125.09 23.81,125.09 v26.04,122.87 26.35,123.19 26.67,123.19 30.8,127.32 49.85,127.32 v53.34,130.81 | v53.34,226.69 46.67,226.69 AB17.AN1
BMB_01  (via drill 0.61)
  Top 0.254: v14.61,46.67 13.97,46.04 v13.97,44.77 | v85.41,11.11 102.87,11.11 v102.87,93.34 | v77.47,121.28 v77.47,221.93
  Bottom 0.254: v14.61,46.67 16.51,48.58 19.68,48.58 20,48.89 D19.D1 | v13.97,44.77 11.75,42.54 9.53,42.54 7.94,40.96 4.13,40.96 3.49,40.32 3.49,28.26 5.4,28.26 6.67,26.99 6.67,22.54 11.11,22.54 26.99,6.67 80.96,6.67 v85.41,11.11 | 76.2,120.01 75.25,120.97 22.86,120.97 21.27,119.38 C19.D1 | 76.2,120.01 v102.87,93.34 | v77.47,221.93 51.44,221.93 49.85,223.52 AB17.AP1 | 76.2,120.01 v77.47,121.28
BMB_02  (via drill 0.61)
  Top 0.254: v20.95,45.4 19.37,46.99 19.37,66.99 20.64,68.26 v20.64,72.39 | v17.78,72.39 16.83,73.34 16.83,76.52 16.19,77.15 16.19,106.36 19.37,109.54 19.37,113.35 v20.95,114.94 | v55.88,219.71 55.88,130.81 50.48,125.41 v50.48,117.79
  Bottom 0.254: v20.95,45.4 22.86,45.4 23.18,45.72 D19.E1 | v17.78,72.39 v20.64,72.39 | C19.E1 23.18,115.57 21.59,115.57 v20.95,114.94 21.27,114.62 30.8,114.62 33.34,117.16 49.85,117.16 v50.48,117.79 | v55.88,219.71 47.31,219.71 46.67,220.34 AB17.AR1
BMB_03  (via drill 0.61)
  Top 0.254: v17.78,36.83 16.19,38.42 16.19,60.96 17.78,62.55 v17.78,68.58 | v19.68,68.58 19.68,73.66 19.37,73.98 19.37,82.23 18.73,82.87 v18.73,92.39 | v19.68,95.57 19.37,95.88 19.37,104.77 20.32,105.73 C19.J1 | v31.43,108.58 31.43,182.56 34.61,185.74 34.61,225.43 33.66,226.38 AB18.AN1
  Bottom 0.254: v17.78,36.83 20,36.83 D19.J1 | v19.68,68.58 v17.78,68.58 | v18.73,92.39 18.73,95.57 v19.68,95.57 | v31.43,108.58 30.48,107.63 22.23,107.63 21.27,106.68 C19.J1
BMB_03_L  (via drill 0.61)
  Top 0.254: v32.38,38.73 32.07,39.05 32.07,62.23 33.66,63.82 v33.66,66.36 | v42.55,67.31 42.23,67.63 42.23,76.52 41.59,77.15 41.59,107 v41.91,107.31
  Bottom 0.254: v32.38,38.73 32.07,38.42 25.4,38.42 24.45,39.37 D19.H1 | v33.66,66.36 34.61,67.31 v42.55,67.31 | v41.91,107.31 38.42,110.81 25.4,110.81 24.45,109.85 C19.H1
BMB_04  (via drill 0.61)
  Top 0.254: v46.35,33.66 44.77,35.24 44.77,85.09 44.13,85.72 44.13,93.66 v43.81,93.98 44.13,94.3 44.13,97.47 43.18,98.42 43.18,100.33 44.13,101.28 44.13,132.08 47.31,135.25 47.31,151.45 40.96,157.8 40.96,223.52 37.15,223.52 AB18.AP1
  Bottom 0.254: v46.35,33.66 47.31,33.66 47.31,29.53 46.67,28.89 44.13,28.89 43.5,28.26 25.4,28.26 24.45,27.3 D19.M1 | v43.81,93.98 42.86,94.93 26.04,94.93 24.45,96.52 C19.M1
BMB_05  (via drill 0.61)
  Top 0.254: 24.45,68.9 24.45,75.25 22.54,77.15 22.54,80.33 23.81,81.6 23.81,83.5 C19.S1 | 24.45,68.9 24.45,61.59 22.54,59.69 22.54,20 22.86,19.68 22.86,15.56 23.5,14.92 D19.S1 | v101.92,68.9 v101.92,196.22 | 24.45,68.9 v24.13,68.9
  Bottom 0.254: v101.92,196.22 79.38,218.76 35.56,218.76 33.97,220.34 AB18.AR1 | v24.13,68.9 v101.92,68.9
BMB_05_L
  Top 0.254: D19.P1 24.13,21.27 25.08,22.22 25.08,85.41 24.13,86.36 24.13,89.85 C19.P1
BMB_06  (via drill 0.61)
  Top 0.254: v42.55,62.86 43.5,63.82 43.5,72.71 v43.18,73.02 | v35.56,80.01 35.24,80.33 35.24,106.36 32.07,109.54 32.07,113.66 v32.38,113.98 | AB19.AN1 20.32,227.65 19.37,228.6 19.37,229.24 18.73,229.87 18.73,230.82 18.1,231.46 16.19,231.46 16.19,117.47 17.14,116.52 C19.E2
  Bottom 0.254: v42.55,62.86 22.54,62.86 22.54,49.21 21.27,47.94 19.68,47.94 18.1,46.35 D19.E2 | v43.18,73.02 36.2,80.01 v35.56,80.01 | v32.38,113.98 19.68,113.98 18.1,115.57 C19.E2
BMB_06_L  (via drill 0.61)
  Top 0.254: v14.61,53.97 14.61,49.85 D19.D2 | v16.51,62.55 16.19,62.86 16.19,76.2 15.56,76.83 15.56,117.47 14.61,118.43 C19.D2
  Bottom 0.254: v14.61,53.97 16.19,55.56 16.19,62.55 v16.51,62.55
BMB_07  (via drill 0.61)
  Top 0.254: v16.19,3.17 16.19,31.75 17.14,32.7 D19.K2 | v88.9,12.06 88.9,134.62 87.31,136.21 v87.31,220.66 | v24.45,106.68 25.08,107.31 25.08,222.25 24.13,223.2 AB19.AP1
  Bottom 0.254: v16.19,3.17 16.51,2.86 79.69,2.86 v88.9,12.06 | v87.31,220.66 82.23,225.74 26.04,225.74 24.45,224.16 AB19.AP1 | v24.45,106.68 20.95,103.19 18.1,103.19 C19.K2
BMB_07_L  (via drill 0.61)
  Top 0.254: v17.14,43.5 17.14,40.32 D19.H2 | v7.62,47.62 6.67,48.58 6.67,77.79 v8.26,79.38 | v13.34,84.45 13.02,84.77 13.02,92.07 12.38,92.71 12.38,105.73 v12.06,106.04
  Bottom 0.254: v17.14,43.5 14.92,45.72 13.34,45.72 11.43,47.62 v7.62,47.62 | v13.34,84.45 v8.26,79.38 | v12.06,106.04 15.24,109.22 16.83,109.22 C19.H2
BMB_08  (via drill 0.61)
  Top 0.254: v29.21,22.54 28.89,22.86 28.89,54.29 v30.48,55.88 | v23.5,61.91 23.18,62.23 v23.18,75.25 | v5.08,219.71 3.49,218.12 3.49,133.35 9.84,127 9.84,114.62 13.02,111.44 13.02,93.03 v14.61,91.44
  Bottom 0.254: v29.21,22.54 19.68,22.54 18.1,20.95 D19.P2 | v30.48,55.88 24.45,61.91 v23.5,61.91 | v23.18,75.25 25.08,77.15 25.08,79.06 24.45,79.06 20.64,82.87 20.64,86.04 20,86.04 17.78,88.26 17.78,89.85 C19.P2 16.83,90.8 15.24,90.8 v14.61,91.44 | v5.08,219.71 6.03,219.71 6.03,227.01 7.3,228.28 9.21,228.28 9.21,223.84 13.65,219.39 19.05,219.39 20,220.34 AB19.AR1
BMB_08_L  (via drill 0.61)
  Top 0.254: v19.68,26.67 19.37,26.35 19.37,21.59 v19.68,21.27 | v56.52,19.37 57.47,20.32 v57.47,92.71
  Bottom 0.254: v19.68,26.67 18.1,26.67 D19.M2 | v19.68,21.27 21.59,19.37 v56.52,19.37 | v57.47,92.71 57.15,92.39 44.13,92.39 43.5,93.03 40.96,93.03 40.32,92.39 24.45,92.39 20.32,96.52 18.1,96.52 C19.M2
BMB_09  (via drill 0.61)
  Top 0.254: D19.S2 17.78,14.92 18.73,15.88 v18.73,69.53 18.73,81.6 17.78,82.55 17.78,83.5 C19.S2 | v72.71,198.44 75.25,195.9 v75.25,119.7
  Bottom 0.254: v72.71,198.44 33.66,198.44 16.51,215.58 6.67,215.58 6.67,221.3 7.3,221.93 7.62,221.93 7.62,226.38 AB20.AN1 | v75.25,119.7 96.84,98.11 96.84,70.48 32.38,70.48 32.07,70.8 22.54,70.8 21.27,69.53 v18.73,69.53
BMB_10  (via drill 0.61)
  Top 0.254: 15.56,64.45 15.56,75.88 14.61,76.83 14.61,80.33 C19.T2 | 15.56,64.45 15.56,12.7 14.61,11.75 D19.T2 | v100.01,67.94 v100.01,196.85 | v15.24,64.45 15.56,64.45
  Bottom 0.254: v100.01,196.85 81.28,215.58 35.56,215.58 29.21,221.93 13.34,221.93 11.75,223.52 AB20.AP1 | v100.01,67.94 96.84,64.77 15.56,64.77 v15.24,64.45
BMB_11  (via drill 0.61)
  Top 0.254: D19.V2 13.97,5.4 13.02,6.35 13.02,73.02 13.97,73.98 C19.V2 | v100.97,25.4 v100.97,193.04
  Bottom 0.254: v100.97,193.04 94.61,199.39 33.66,199.39 16.83,216.22 8.26,216.22 8.26,220.03 AB20.AR1 | v100.97,25.4 81.6,6.03 15.88,6.03 14.92,5.08 D19.V2
BTS_1  (via drill 0.61)
  Top 0.254: v77.15,1.91 81.92,6.67 81.92,53.66 80.33,55.24 v80.33,71.44 80.01,71.75 79.69,72.07 79.69,90.8 81.28,92.39 81.28,116.84 79.38,118.74 79.38,219.71 v78.42,220.66
  Bottom 0.254: v77.15,1.91 15.24,1.91 11.11,6.03 1.91,6.03 1.91,10.48 D20.T2 | v80.33,71.44 7.94,71.44 3.81,75.56 3.81,76.83 3.17,76.83 0.95,79.06 0.95,80.64 C20.T2 | v78.42,220.66 51.75,220.66 50.48,221.93 45.09,221.93 43.5,223.52 AB17.AP2
BTS_3  (via drill 0.61)
  Top 0.254: D20.S2 4.45,14.92 3.49,15.88 3.49,64.13 4.13,64.77 v4.13,66.67 4.13,76.52 3.49,77.15 3.49,82.55 4.45,83.5 C20.S2 | v92.71,67.94 v92.71,207.96
  Bottom 0.254: v92.71,207.96 75.56,225.11 40.01,225.11 40.01,221.3 AB17.AR2 | v92.71,67.94 92.39,68.26 31.75,68.26 30.16,66.67 v4.13,66.67
C1_1_CYCLE  (via drill 0.61)
  Top 0.254: v55.88,35.56 55.88,33.97 D16.K2 | v76.83,44.77 77.15,45.08 77.15,53.66 76.83,53.97 76.83,70.17 76.2,70.8 76.2,94.93 76.83,95.57 v76.83,101.92 77.15,102.23 77.15,119.06 75.88,120.33 75.88,238.44 v54.29,260.03
  Bottom 0.254: v55.88,35.56 56.2,35.24 67.31,35.24 v76.83,44.77 | v76.83,101.92 57.15,101.92 56.2,102.87 C16.K2 | v54.29,260.03 49.21,260.03 47.94,261.3 44.77,261.3 44.13,260.67 12.7,260.67 11.75,261.62 AB20.AA1
C1_B_BREAK_L  (via drill 0.61)
  Top 0.254: v64.14,23.49 70.17,29.53 70.17,48.26 69.53,48.89 69.53,56.52 68.9,57.15 68.9,86.68 v69.22,87 69.53,87.31 69.53,124.78 69.22,125.09 69.22,125.73 70.8,127.32 70.8,194.31 71.12,194.63 v71.12,229.87
  Bottom 0.254: v64.14,23.49 61.91,23.49 60.33,21.91 44.45,21.91 43.5,20.95 D17.P2 | v69.22,87 66.99,89.22 44.45,89.22 43.5,90.17 C17.P2 | v71.12,229.87 69.53,231.46 29.21,231.46 27.62,233.04 AB18.AL2
C1_B_DATA_00  (via drill 0.61)
  Top 0.254: v69.85,57.47 70.17,57.78 v70.17,125.41
  Bottom 0.254: v69.85,57.47 60.96,57.47 59.37,55.88 D16.B1 | v70.17,125.41 59.37,125.41 C16.B1
C1_B_DATA_01  (via drill 0.61)
  Top 0.254: v70.48,50.48 70.8,50.8 70.8,117.79 v71.12,118.11
  Bottom 0.254: v70.48,50.48 66.36,50.48 65.72,49.85 59.69,49.85 59.37,49.53 D16.D1 | v71.12,118.11 70.17,119.06 59.37,119.06 C16.D1
C1_B_DATA_02  (via drill 0.61)
  Top 0.254: v70.48,49.21 71.44,50.16 71.44,114.62 v71.75,114.94
  Bottom 0.254: v70.48,49.21 67.94,46.67 62.87,46.67 62.55,46.35 D16.E1 | v71.75,114.94 71.12,115.57 62.55,115.57 C16.E1
C1_B_DATA_03  (via drill 0.61)
  Top 0.254: v73.34,46.99 73.03,47.31 73.03,52.07 73.34,52.39 73.34,68.9 72.71,69.53 72.71,105.73 73.34,106.36 v73.34,109.54
  Bottom 0.254: v73.34,46.99 69.22,42.86 65.41,42.86 62.55,40 D16.H1 | v73.34,109.54 62.55,109.54 C16.H1
C1_B_DATA_04  (via drill 0.61)
  Top 0.254: v72.07,42.54 72.07,106.36 v72.39,106.68
  Bottom 0.254: v72.07,42.54 66.36,36.83 59.37,36.83 D16.J1 | v72.39,106.68 59.37,106.68 C16.J1
C1_B_DATA_05
  Top 0.254: D16.L1 59.05,30.8 59.37,31.11 59.37,35.24 60.01,35.88 60.01,98.42 59.05,99.38 C16.L1
C1_B_DATA_06  (via drill 0.61)
  Top 0.254: v73.66,97.47 73.66,69.53 73.98,69.21 73.98,52.07 73.66,51.75 73.66,51.12 74.61,50.16 74.61,42.54 71.75,39.69 71.75,19.37 61.28,19.37 60.64,20 60.64,25.4 61.59,26.35 D16.M1
  Bottom 0.254: v73.66,97.47 73.34,97.16 62.55,97.16 C16.M1
C1_B_DATA_07
  Top 0.254: D16.P1 62.23,21.27 63.18,22.22 63.18,88.9 62.23,89.85 C16.P1
C1_B_DATA_08
  Top 0.254: D16.S1 61.59,14.92 60.01,16.51 60.01,34.92 60.64,35.56 60.64,78.42 61.91,79.69 61.91,83.5 C16.S1
C1_B_DATA_09  (via drill 0.61)
  Top 0.254: v74.61,51.43 74.61,69.53 74.3,69.85 74.3,96.84 74.61,97.16 v74.61,113.35
  Bottom 0.254: v74.61,51.43 66.36,51.43 65.41,50.48 53.98,50.48 53.02,49.53 D16.D2 | v74.61,113.35 69.53,118.43 60.01,118.43 59.37,117.79 53.98,117.79 53.02,118.74 C16.D2
C1_B_DATA_10  (via drill 0.61)
  Top 0.254: v75.56,50.48 75.56,69.53 74.93,70.17 74.93,96.52 75.25,96.84 75.25,109.54 v75.56,109.85
  Bottom 0.254: v75.56,50.48 69.85,44.77 57.15,44.77 56.2,45.72 D16.E2 | v75.56,109.85 70.8,114.62 57.15,114.62 56.2,115.57 C16.E2
C1_B_DATA_11  (via drill 0.61)
  Top 0.254: v76.2,47.94 76.52,48.26 76.52,53.34 76.2,53.66 76.2,69.85 75.56,70.48 75.56,96.2 75.88,96.52 75.88,105.09 v76.2,105.41
  Bottom 0.254: v76.2,47.94 68.9,40.64 67.63,40.64 65.41,38.42 57.15,38.42 56.2,39.37 D16.H2 | v76.2,105.41 72.71,108.9 63.18,108.9 62.55,108.27 57.15,108.27 56.2,109.22 C16.H2
C1_B_INITIALIZE_2
  Top 0.254: D17.V2 39.37,5.4 38.42,6.35 38.42,56.2 39.69,57.47 39.69,73.98 C17.V2
C1_B_WC_OVERFLOW_L
  Top 0.254: D16.P2 55.88,21.27 56.83,22.22 56.83,88.9 55.88,89.85 C16.P2
C1_BADD_ACC_0_L
  Top 0.254: D17.S2 43.18,14.92 44.13,15.88 44.13,82.55 43.18,83.5 C17.S2
C1_BRK_H
  Bottom 0.254: AB20.BR1 8.26,150.18 10.48,147.95 AB20.BS1
C1_BRK_L
  Top 0.254: 35.24,182.25 33.97,182.25 AB18.BD1 | 35.24,182.25 39.05,182.25 AB17.BD2 | 35.24,182.25 35.24,209.55 36.2,210.5 AB18.AU1
  Bottom 0.254: AB18.BD1 32.7,182.25 27.62,182.25 AB18.BD2 26.35,182.25 25.4,181.29 12.7,181.29 | AB19.BS1 23.18,147.95 20.95,150.18 AB19.BR1 20,151.13 18.41,152.72 16.83,152.72 3.49,166.05 3.49,181.29 | 3.49,181.29 12.7,181.29 | 3.49,181.29 3.17,181.29 2.22,182.25 AB20.BD2 | 12.7,181.29 13.65,182.25 AB19.BD2
C1_BRK_RQST_L  (via drill 0.61)
  Top 0.254: v67.94,34.61 68.26,34.92 68.26,55.88 67.63,56.52 67.63,93.34 68.58,94.3 v68.58,100.65 | v64.14,251.46 76.52,239.08 76.52,120.65 79.38,117.79 v79.38,102.87
  Bottom 0.254: v67.94,34.61 44.45,34.61 43.5,33.66 D17.K2 | C17.K2 43.5,102.87 43.81,102.87 45.4,101.28 67.94,101.28 v68.58,100.65 68.9,100.97 77.47,100.97 v79.38,102.87 | v64.14,251.46 50.16,251.46 41.59,260.03 22.23,260.03 21.27,259.08 AB19.AB1
C1_C1_L
  Top 0.254: AB17.BJ1 46.67,170.18 48.9,172.4 AB17.BH1
C1_CA_INCREMENT_L  (via drill 0.61)
  Top 0.254: v72.71,29.21 77.79,34.29 77.79,53.97 77.47,54.29 77.47,70.48 76.83,71.12 76.83,93.98 77.47,94.61 v77.47,94.93
  Bottom 0.254: v72.71,29.21 62.23,29.21 60.64,27.62 56.52,27.62 56.2,27.3 D16.M2 | v77.47,94.93 73.98,98.42 60.96,98.42 59.69,97.16 56.2,97.16 C16.M2
C1_DATA_ADD_00_L  (via drill 0.61)
  Top 0.254: v51.44,59.05 51.12,59.37 51.12,92.71 47.94,95.88 47.94,113.66 47.31,114.3 47.31,123.82 46.35,124.78 C17.B1 | v52.7,250.51 66.36,236.85 v66.36,124.46
  Bottom 0.254: v51.44,59.05 49.85,57.47 48.26,57.47 46.67,55.88 D17.B1 | v52.7,250.51 35.56,250.51 33.97,252.09 AB18.AD1 | v66.36,124.46 66.04,124.14 47.62,124.14 46.67,125.09 C17.B1
C1_DATA_ADD_01_L  (via drill 0.61)
  Top 0.254: v45.72,53.02 45.72,49.85 D17.D1 | v38.73,59.69 38.42,60.01 38.42,84.14 40.96,86.68 v40.96,118.11 | v61.59,247.97 68.26,241.3 68.26,126.68 67.31,125.73 v67.31,117.47
  Bottom 0.254: v45.72,53.02 39.05,59.69 v38.73,59.69 | v40.96,118.11 41.59,118.74 45.4,118.74 C17.D1 46.67,118.74 50.8,118.74 52.39,117.16 66.99,117.16 v67.31,117.47 | v61.59,247.97 38.1,247.97 37.15,248.92 AB18.AE1
C1_DATA_ADD_02_L  (via drill 0.61)
  Top 0.254: v64.14,47.62 63.82,47.94 v63.82,112.39 63.82,112.71 63.82,234.63 v54.29,244.16
  Bottom 0.254: v64.14,47.62 63.82,47.31 50.8,47.31 49.85,46.35 D17.E1 | v63.82,112.39 62.23,113.98 54.61,113.98 53.02,115.57 49.85,115.57 C17.E1 | v54.29,244.16 38.73,244.16 34.92,247.97 27.3,247.97 27.3,251.78 AB18.AD2
C1_DATA_ADD_03_L  (via drill 0.61)
  Top 0.254: v64.14,42.86 65.09,43.81 65.09,47.94 64.45,48.58 64.45,107.31 v64.77,107.63 64.77,107.95 64.77,234.63 58.42,240.98 58.42,241.94 v55.24,245.11 | v42.55,245.11 42.55,244.79 39.05,244.79 35.24,248.6 35.24,248.92 30.8,248.92 AB18.AE2
  Bottom 0.254: v64.14,42.86 62.23,40.96 50.8,40.96 49.85,40 D17.H1 | v64.77,107.63 51.44,107.63 49.85,109.22 C17.H1 | v42.55,245.11 42.86,244.79 53.66,244.79 53.98,245.11 v55.24,245.11
C1_DATA_ADD_04_L  (via drill 0.61)
  Top 0.254: v66.04,37.78 65.72,38.1 65.72,48.26 65.09,48.89 65.09,104.46 v65.41,104.77 65.72,105.09 65.72,107.95 65.41,108.27 65.41,235.58 v59.37,241.62
  Bottom 0.254: v66.04,37.78 47.62,37.78 46.67,36.83 D17.J1 | v65.41,104.77 65.09,105.09 60.33,105.09 59.69,104.46 50.8,104.46 49.21,106.04 46.67,106.04 C17.J1 | v59.37,241.62 40.32,241.62 34.61,247.33 8.26,247.33 8.26,251.78 AB20.AD1
C1_DATA_ADD_05_L  (via drill 0.61)
  Top 0.254: D17.L1 46.35,30.8 47.31,31.75 47.31,98.42 46.35,99.38 C17.L1 | v15.24,158.43 15.56,158.75 15.56,248.92 11.75,248.92 AB20.AE1 | v34.61,139.06 35.24,138.43 35.24,107.31 36.83,105.73 v36.83,105.41
  Bottom 0.254: v34.61,139.06 v15.24,158.43 | v36.83,105.41 40.32,101.92 43.81,101.92 45.4,100.33 C17.L1
C1_DATA_ADD_06_L  (via drill 0.61)
  Top 0.254: v64.77,32.38 66.99,34.61 66.99,42.86 66.36,43.5 66.36,48.58 65.72,49.21 65.72,94.61 v66.04,94.93 | AB20.AD2 1.91,253.05 3.49,254.63 3.49,256.22 7.3,260.03 32.07,260.03 32.07,256.86 50.48,238.44 51.44,238.44 51.44,132.72 47.94,129.22 47.94,114.62 50.48,112.08 50.48,98.42 49.53,97.47 C17.M1
  Bottom 0.254: v64.77,32.38 64.45,32.38 60.33,28.26 50.8,28.26 49.85,27.3 D17.M1 | v66.04,94.93 51.44,94.93 49.85,96.52 C17.M1
C1_DATA_ADD_07_L  (via drill 0.61)
  Top 0.254: 50.48,73.34 50.48,88.9 49.53,89.85 C17.P1 | 50.48,73.34 50.48,22.22 49.53,21.27 D17.P1 | v77.47,236.22 80.01,233.68 80.01,126.68 83.19,123.51 83.19,108.27 82.87,107.95 v82.87,74.93 | 50.48,73.34 v50.16,73.34
  Bottom 0.254: v77.47,236.22 63.5,236.22 58.74,240.98 22.86,240.98 19.68,244.16 5.08,244.16 5.08,248.6 AB20.AE2 | v82.87,74.93 81.28,73.34 v50.16,73.34
C1_DATA_ADD_08_L  (via drill 0.61)
  Top 0.254: D17.S1 48.9,14.92 47.94,15.88 47.94,82.55 48.9,83.5 C17.S1 | v46.35,212.09 44.77,213.68 44.77,230.19 25.72,249.24 25.72,252.09 21.27,252.09 AB19.AD1 | v80.96,201.29 86.36,195.9 v86.36,85.72
  Bottom 0.254: v46.35,212.09 57.15,201.29 v80.96,201.29 | v86.36,85.72 84.14,83.5 64.45,83.5 62.55,85.41 50.8,85.41 49.85,84.45 C17.S1
C1_DATA_ADD_09_L  (via drill 0.61)
  Top 0.254: v41.91,50.16 41.59,50.48 41.59,76.2 40.96,76.83 40.96,83.82 v40.32,84.45 | v38.42,86.36 37.78,87 37.78,117.79 v37.47,118.11 | v30.48,119.38 30.48,119.7 25.72,124.46 25.72,223.84 19.37,230.19 19.37,248.92 23.18,248.92 AB19.AE1
  Bottom 0.254: v41.91,50.16 40.96,50.16 40.32,49.53 D17.D2 | v38.42,86.36 v40.32,84.45 | C17.D2 39.05,118.74 38.1,118.74 v37.47,118.11 37.15,117.79 32.07,117.79 v30.48,119.38
C1_DATA_ADD_10_L  (via drill 0.61)
  Top 0.254: v66.67,49.53 66.36,49.85 66.36,93.98 66.99,94.61 v66.99,110.49 | v41.91,110.81 42.55,111.44 42.55,115.25 C17.E2 42.55,116.52 42.55,117.79 41.59,118.74 41.59,143.83 v41.27,144.14 | v42.86,157.16 41.59,158.43 41.59,227.01 25.08,243.52 25.08,250.51 20.64,250.51 19.37,251.78 19.37,252.09 14.92,252.09 AB19.AD2
  Bottom 0.254: v66.67,49.53 66.36,49.21 64.45,49.21 63.18,47.94 45.09,47.94 43.5,46.35 D17.E2 | v66.99,110.49 66.67,110.81 v41.91,110.81 | v42.86,157.16 40.96,155.26 40.96,144.14 v41.27,144.14
C1_DATA_ADD_11_L  (via drill 0.61)
  Top 0.254: v67.31,43.81 67.63,44.13 67.63,55.56 66.99,56.2 66.99,93.66 67.63,94.3 67.63,104.46 v67.94,104.77 68.26,105.09 68.26,125.73 68.9,126.36 68.9,236.85 v69.22,237.17
  Bottom 0.254: v67.31,43.81 63.82,43.81 61.59,41.59 45.09,41.59 43.5,40 D17.H2 | v67.94,104.77 66.99,105.73 60.01,105.73 59.37,105.09 51.12,105.09 46.99,109.22 43.5,109.22 C17.H2 | v69.22,237.17 59.05,247.33 36.51,247.33 30.16,253.68 17.78,253.68 17.78,249.87 AB19.AE2
C1_DATA_IN  (via drill 0.61)
  Top 0.254: v67.94,33.34 68.9,34.29 68.9,56.2 68.26,56.83 68.26,88.58 v68.58,88.9 | v43.18,92.07 42.86,92.39 42.86,96.2 C17.M2 | v6.03,177.48 6.03,256.54 7.62,258.13 AB20.AB1 | v38.42,148.91 38.42,91.76 v38.73,91.44
  Bottom 0.254: v67.94,33.34 64.45,33.34 60.01,28.89 50.48,28.89 49.85,28.26 44.45,28.26 43.5,27.3 D17.M2 | v68.58,88.9 65.72,91.76 43.5,91.76 v43.18,92.07 42.86,91.76 39.05,91.76 v38.73,91.44 | v6.03,177.48 6.03,174.31 13.02,174.31 v38.42,148.91
C1_EXT_DATA_ADD_0_L  (via drill 0.61)
  Top 0.254: D16.V2 52.07,5.4 51.12,6.35 51.12,57.47 52.39,58.74 52.39,73.98 C16.V2 | v91.44,235.58 93.66,233.36 v93.66,79.69
  Bottom 0.254: v91.44,235.58 78.11,248.92 49.85,248.92 AB17.AE1 | v93.66,79.69 89.85,75.88 53.98,75.88 53.02,74.93 C16.V2
C1_EXT_DATA_ADD_1_L
  Top 0.254: D16.T2 52.7,11.75 53.66,12.7 53.66,79.38 52.7,80.33 C16.T2 52.7,81.6 52.7,83.19 55.24,85.72 55.24,88.58 54.29,89.53 54.29,97.47 59.05,102.23 59.05,103.82 57.47,105.41 57.47,109.54 56.52,110.49 56.52,112.08 56.83,112.39 56.83,239.08 51.75,244.16 51.75,254.95 46.67,260.03 45.4,260.03 44.77,259.4 44.77,252.73 40.32,252.73 AB17.AD2
C1_EXT_DATA_ADD_2_L  (via drill 0.61)
  Top 0.254: 54.29,79.69 54.29,82.55 55.24,83.5 C16.S2 | 54.29,79.69 54.29,15.88 55.24,14.92 D16.S2 | v50.48,239.71 44.77,245.43 44.77,247.01 43.18,248.6 AB17.AE2 | v57.78,237.17 63.18,231.77 63.18,113.35 62.87,113.03 62.87,110.49 63.18,110.17 63.18,93.66 60.64,91.12 60.64,80.33 v60.96,80.01 | v54.61,79.69 54.29,79.69
  Bottom 0.254: v50.48,239.71 53.02,237.17 v57.78,237.17 | v60.96,80.01 60.64,79.69 v54.61,79.69
C1_IO_PAUSE
  Bottom 0.254: AB18.BS1 35.88,147.95 33.66,150.18 AB18.BR1
C1_MB_INCREMENT_L
  Top 0.254: D17.T2 40.01,11.75 40.96,12.7 40.96,75.88 40.01,76.83 40.01,80.33 C17.T2
GND  (via drill 0.61)
  Top 0.254: 155.89,214 159.7,214 A07.T1 | 155.89,214 154.62,214 A07.T2 154.31,214.95 155.26,215.9 155.26,226.69 | 155.26,226.69 159.7,226.69 A07.N1 | 155.26,226.69 154.62,226.69 A07.N2 154.31,227.65 155.26,228.6 155.26,245.75 | 155.26,245.75 159.7,245.75 A07.F1 | 155.26,245.75 154.62,245.75 A07.F2 154.31,246.7 155.89,248.28 155.89,254 156.84,254.95 A07.C2 | 158.43,144.14 159.7,144.14 B07.T1 | 158.43,144.14 154.62,144.14 B07.T2 154.31,145.1 155.26,146.05 155.26,156.84 | 155.26,156.84 159.7,156.84 B07.N1 | 155.26,156.84 154.62,156.84 B07.N2 154.31,157.8 155.26,158.75 155.26,175.89 | 155.26,175.89 159.7,175.89 B07.F1 160.02,176.85 159.07,177.8 159.07,185.42 | 155.26,175.89 154.62,175.89 B07.F2 | 159.07,185.42 162.88,185.42 B07.C1 | 159.07,185.42 157.8,185.42 B07.C2 156.84,186.37 155.89,187.32 155.89,214 | D07.T1 159.7,10.79 154.62,10.79 D07.T2 154.31,11.75 155.26,12.7 155.26,23.49 | 155.26,23.49 159.7,23.49 D07.N1 | 155.26,23.49 154.62,23.49 D07.N2 154.31,24.45 155.26,25.4 155.26,42.54 | 155.26,42.54 159.7,42.54 D07.F1 160.02,43.5 159.07,44.45 159.07,52.07 | 155.26,42.54 154.62,42.54 D07.F2 | 159.07,52.07 162.88,52.07 D07.C1 | 159.07,52.07 157.8,52.07 D07.C2 156.84,53.02 155.89,53.97 155.89,80.64 | 155.89,80.64 159.7,80.64 C07.T1 | 155.89,80.64 154.62,80.64 C07.T2 154.31,81.6 155.26,82.55 155.26,93.34 | 155.26,93.34 159.7,93.34 C07.N1 | 155.26,93.34 154.62,93.34 C07.N2 154.31,94.3 155.26,95.25 155.26,112.39 | 155.26,112.39 159.7,112.39 C07.F1 160.02,113.35 159.07,114.3 159.07,121.92 | 155.26,112.39 154.62,112.39 C07.F2 | 159.07,121.92 162.88,121.92 C07.C1 | 158.43,121.92 159.07,121.92
  Top 0.254: 158.43,121.92 157.8,121.92 C07.C2 | 158.43,121.92 158.43,144.14 | D16.A1 61.59,58.1 61.59,53.02 D16.C1 | D18.C1 36.2,53.02 36.2,58.1 D18.A1 36.2,59.37 v36.2,73.66 | D17.A1 48.9,58.1 48.9,53.02 D17.C1 | D16.U2 56.2,8.25 58.42,10.48 D16.T1 58.42,11.75 58.42,16.83 D16.R1 58.42,18.1 58.42,23.18 D16.N1 | D17.U2 43.5,8.25 45.72,10.48 D17.T1 45.72,11.75 45.72,16.83 D17.R1 45.72,18.1 45.72,23.18 D17.N1 | D16.R2 52.07,18.1 52.07,23.18 D16.N2 52.07,24.45 52.07,29.53 D16.L2 52.07,30.8 52.07,35.88 D16.J2 52.07,37.15 52.07,42.23 D16.F2 | D20.A1 10.79,58.1 10.79,53.02 D20.C1 | D20.U2 5.4,8.25 7.62,10.48 D20.T1 7.62,11.75 7.62,16.83 D20.R1 7.62,18.1 7.62,23.18 D20.N1 | D20.R2 1.27,18.1 1.27,23.18 D20.N2 1.27,24.45 1.27,29.53 D20.L2 1.27,30.8 1.27,35.88 D20.J2 1.27,37.15 1.27,42.23 D20.F2 | D19.R2 13.97,18.1 13.97,23.18 D19.N2 13.97,24.45 13.97,29.53 D19.L2 13.97,30.8 v13.97,32.38 13.97,32.7 13.97,35.88 D19.J2 13.97,37.15 13.97,42.23 D19.F2 | v4.45,47.62 4.45,51.75 D20.C2 | D19.U2 18.1,8.25 20.32,10.48 D19.T1 20.32,11.75 20.32,16.83 D19.R1 20.64,18.1 20.64,23.18 D19.N1 | D18.U2 30.8,8.25 33.02,10.48 D18.T1 33.02,11.75 33.02,16.83 D18.R1 33.02,18.1 33.02,23.18 D18.N1 | D19.C1 23.5,53.02 23.5,58.1 D19.A1 | D18.R2 26.67,18.1 26.67,23.18 D18.N2 26.67,24.45 26.67,29.53 D18.L2 26.67,30.8 26.67,35.88 D18.J2 26.67,37.15 26.67,42.23 D18.F2 | D17.R2 39.37,18.1 39.37,23.18 D17.N2 39.37,24.45 39.37,29.53 D17.L2 39.37,30.8 39.37,35.88 D17.J2 | AB20.AT1 7.62,213.68 7.62,208.6 AB20.AV1 7.62,207.33 6.67,206.38 6.67,184.15 7.62,183.2 AB20.BD1 | AB19.AV1 20.32,208.6 20.32,213.68 AB19.AT1
  Top 0.254: 3.49,234.95 4.45,235.9 AB20.AK2 | 3.49,234.95 2.22,233.68 AB20.AL2 | 3.49,234.95 3.49,249.87 4.13,250.51 4.13,254.63 4.45,254.95 AB20.AC2 | AB17.BD1 45.4,182.88 43.18,185.1 AB17.BC2 | AB19.BL1 21.27,163.83 23.5,166.05 AB19.BK1 23.18,167 20.95,169.23 AB19.BJ1 21.27,170.18 23.5,172.4 AB19.BH1 | 33.02,140.02 33.02,143.83 AB18.BT1 33.66,145.1 34.61,146.05 34.61,157.48 | 33.02,140.02 33.02,138.75 AB18.BV1 | AB17.BL1 46.67,163.83 48.9,166.05 AB17.BK1 | 34.61,164.47 36.2,166.05 AB18.BK1 35.88,167 33.66,169.23 AB18.BJ1 33.97,170.18 36.2,172.4 AB18.BH1 | 34.61,164.47 33.97,163.83 AB18.BL1 | 34.61,157.48 39.05,157.48 AB17.BN2 | 34.61,157.48 34.61,164.47 | AB19.BV1 20.32,138.75 20.32,143.83 AB19.BT1 | AB20.BT1 7.62,143.83 7.62,138.75 AB20.BV1 8.26,137.48 10.79,134.94 10.79,129.22 C20.A1 10.79,127.95 10.79,122.87 C20.C1 | C19.A1 23.5,127.95 23.5,122.87 C19.C1 | C18.C1 36.2,122.87 36.2,127.95 C18.A1 36.2,129.22 36.2,140.02 33.02,140.02 | C17.A1 48.9,127.95 48.9,122.87 C17.C1 | C16.A1 61.59,127.95 61.59,122.87 C16.C1 61.59,121.6 60.01,120.01 60.01,111.12 | C20.R2 1.27,87.95 1.27,93.03 C20.N2 1.27,94.3 1.27,99.38 C20.L2 1.27,100.65 1.27,105.73 C20.J2 1.27,107 1.27,112.08 C20.F2 | C20.N1 7.62,93.03 7.62,87.95 C20.R1 7.62,86.68 7.62,81.6 C20.T1 | C19.N2 13.97,94.3 13.97,99.38 C19.L2 13.97,100.65 13.97,105.73 C19.J2 13.97,107 13.97,112.08 C19.F2 | C16.T1 58.42,81.6 58.42,86.68 C16.R1 58.42,87.95 58.42,93.03 C16.N1 | C17.T1 46.04,81.6 46.04,86.68 C17.R1 45.72,87.95 45.72,93.03 C17.N1 | C16.R2 52.07,87.95 52.07,93.03 C16.N2 52.39,94.3 52.39,99.38 C16.L2 52.07,100.65 52.07,105.73 C16.J2 52.07,107 52.07,112.08 C16.F2
  Top 0.254: C18.T1 33.02,81.6 33.02,86.68 C18.R1 33.02,87.95 33.02,93.03 C18.N1 | C17.R2 39.69,87.95 39.69,93.03 C17.N2 39.37,94.3 39.37,99.38 C17.L2 39.37,100.65 39.37,105.73 C17.J2 39.37,107 39.37,112.08 C17.F2 | 60.01,111.12 60.01,105.41 61.59,103.82 C16.K1 | 60.01,111.12 59.05,112.08 C16.F1 | C18.F2 26.67,112.08 26.67,107 C18.J2 | C19.T1 20.64,81.6 20.64,86.68 C19.R1 20.32,87.95 20.32,93.03 C19.N1 | C18.L2 26.67,99.38 26.67,94.3 C18.N2 26.67,93.03 26.67,87.95 C18.R2 27.3,86.68 27.3,85.09 29.53,82.87 29.53,78.74 29.84,78.42 C18.U2
  Bottom 0.254: A07.C2 157.8,255.27 162.88,255.27 A07.C1 | D16.C1 61.28,52.07 56.2,52.07 D16.C2 54.93,52.39 49.85,52.39 D17.C1 48.58,52.07 43.5,52.07 D17.C2 42.23,52.07 37.15,52.07 D18.C1 35.88,52.39 30.8,52.39 D18.C2 30.48,51.75 30.48,47.31 30.8,47.31 35.56,42.54 | D16.R2 51.75,17.14 46.67,17.14 D17.R1 | D16.N1 58.1,23.49 53.02,23.49 D16.N2 | 35.56,42.54 39.05,42.54 D17.F2 40.32,42.54 45.4,42.54 D17.F1 46.67,42.54 51.75,42.54 D16.F2 53.02,42.54 58.1,42.54 D16.F1 | 35.56,42.54 33.97,42.54 D18.F1 | 50.8,31.43 51.75,30.48 D16.L2 | 50.8,31.43 49.53,32.7 D17.K1 | 50.8,31.43 59.69,31.43 61.28,33.02 D16.K1 | D20.C2 5.4,52.07 10.48,52.07 D20.C1 11.75,52.07 16.83,52.07 D19.C2 | D20.R2 2.22,17.14 7.3,17.14 D20.R1 8.57,17.14 13.65,17.14 D19.R2 | D20.F1 7.3,42.54 2.22,42.54 D20.F2 1.91,43.5 1.91,45.08 v4.45,47.62 | v13.97,32.38 12.38,32.38 11.75,33.02 D20.K1 | D19.F2 14.92,42.54 20,42.54 D19.F1 21.27,42.54 26.35,42.54 D18.F2 26.67,43.5 26.67,45.72 23.81,48.58 23.18,48.58 23.18,49.85 23.5,50.16 23.5,51.75 D19.C1 | D19.K1 24.45,33.02 25.4,32.07 34.92,32.07 35.88,33.02 D18.K1 37.15,33.66 39.37,35.88 D17.J2 | D18.R2 27.62,17.14 32.7,17.14 D18.R1 33.97,17.14 39.05,17.14 D17.R2 | D19.N1 21.27,23.49 26.35,23.49 D18.N2 | D17.N1 45.4,23.49 40.32,23.49 D17.N2 | AB17.AT1 45.4,214 44.45,213.04 34.92,213.04 33.97,214 AB18.AT1 32.7,214.63 31.75,215.58 22.23,215.58 21.27,214.63 AB19.AT1 | AB20.AV1 8.57,207.64 9.53,206.69 19.05,206.69 20,207.64 AB19.AV1 | AB20.AT1 7.3,214.63 6.67,214.63 5.71,215.58 1.91,215.58 1.91,220.03 AB20.AR2 2.22,220.98 4.45,223.2 AB20.AP2 4.45,224.47 4.45,228.92 4.13,228.92 1.91,231.14 1.91,232.73 AB20.AL2
  Bottom 0.254: 15.88,254.32 6.35,254.32 5.4,255.27 AB20.AC2 | 15.88,254.32 16.83,255.27 AB19.AC2 | 28.57,254.32 29.53,255.27 AB18.AC2 | 15.88,254.32 28.57,254.32 | 28.57,254.32 41.27,254.32 42.23,255.27 AB17.AC2 | 15.88,237.81 16.83,236.85 AB19.AK2 | 15.88,237.81 6.35,237.81 5.4,236.85 AB20.AK2 | 28.57,237.81 29.53,236.85 AB18.AK2 | 15.88,237.81 28.57,237.81 | 28.57,237.81 41.27,237.81 42.23,236.85 AB17.AK2 | 6.35,183.83 5.08,185.1 AB20.BC2 | 6.35,183.83 7.3,182.88 AB20.BD1 | 15.88,184.47 15.24,183.83 6.35,183.83 | 15.88,184.47 16.83,185.42 AB19.BC2 | 28.57,184.47 29.53,185.42 AB18.BC2 | 28.57,184.47 15.88,184.47 | 28.57,184.47 41.27,184.47 42.23,185.42 AB17.BC2 | AB20.BL1 8.57,163.83 10.79,166.05 AB20.BK1 | AB20.BK1 10.48,167 8.26,169.23 AB20.BJ1 8.57,170.18 10.79,172.4 AB20.BH1 | AB20.BK1 11.75,166.37 13.34,164.78 19.05,164.78 20,163.83 AB19.BL1 | AB17.BT1 45.4,144.14 44.45,143.19 34.92,143.19 33.97,144.14 AB18.BT1 | AB17.BL1 45.4,163.83 43.81,165.42 38.1,165.42 37.15,166.37 AB18.BK1 | AB19.BH1 24.45,172.72 26.04,171.13 31.75,171.13 32.7,170.18 AB18.BJ1 | AB17.BD1 45.72,181.93 45.72,177.48 42.86,177.48 38.73,173.35 37.15,173.35 AB18.BH1 | C20.C2 5.4,121.92 10.48,121.92 C20.C1 11.75,121.92 16.83,121.92 C19.C2 18.1,121.92 23.18,121.92 C19.C1 24.45,121.92 29.53,121.92 C18.C2 30.8,121.92 35.88,121.92 C18.C1 37.15,121.92 42.23,121.92 C17.C2 43.5,121.92 48.58,121.92 C17.C1 49.85,121.92 54.93,121.92 C16.C2 56.2,121.92 61.28,121.92 C16.C1 62.55,122.24 156.53,122.24 C07.C2 | AB19.BV1 20,137.79 19.05,136.84 9.53,136.84 8.57,137.79 AB20.BV1 | C20.U2 5.4,78.1 7.62,80.33 C20.T1 | C20.R2 2.22,87.31 7.3,87.31 C20.R1 8.57,87 13.65,87 C19.R2
  Bottom 0.254: C20.F1 7.3,112.39 2.22,112.39 C20.F2 | C19.N2 13.65,93.34 8.57,93.34 C20.N1 | C20.K1 10.48,102.87 9.53,101.92 3.81,101.92 2.22,100.33 C20.L2 | C19.F2 14.92,112.39 20,112.39 C19.F1 21.27,112.39 26.35,112.39 C18.F2 27.62,112.39 32.7,112.39 C18.F1 33.97,112.39 39.05,112.39 C17.F2 40.32,112.71 45.4,112.71 C17.F1 46.67,112.39 51.75,112.39 C16.F2 53.02,112.71 58.1,112.71 C16.F1 | C16.U2 54.93,78.1 53.66,79.38 53.66,80.64 58.1,80.64 C16.T1 | C16.R2 51.75,87 46.67,87 C17.R1 | C16.N1 58.1,93.66 53.02,93.66 C16.N2 | C17.R2 39.05,87.31 33.97,87.31 C18.R1 | C17.U2 42.23,78.1 40.64,79.69 37.47,79.69 36.2,80.96 33.97,80.96 C18.T1 | C18.K1 36.2,103.82 36.2,104.77 35.88,105.09 35.88,106.36 39.05,106.36 C17.J2 40.32,106.04 41.91,104.46 47.62,104.46 48.58,103.5 C17.K1 | C18.J2 26.67,105.73 24.45,103.5 C19.K1 24.13,102.55 24.13,100.65 26.67,100.65 C18.L2 | C19.U2 18.1,78.1 20.32,80.33 C19.T1 | C18.R2 26.35,87 21.27,87 C19.R1 | v36.2,73.66 32.38,77.47 30.8,77.47 C18.U2
INT_RQST_BUS_L  (via drill 0.61)
  Top 0.254: v30.48,24.13 30.48,26.35 D18.M2 | 90.49,62.86 v90.49,77.79 | v90.49,40.32 90.49,62.86 | v29.84,88.9 28.89,89.85 28.89,95.25 29.84,96.2 C18.M2 | 90.49,62.86 93.66,66.04 93.66,77.15 98.11,81.6 98.11,263.21 42.23,263.21 38.42,259.4 38.42,259.08 33.97,259.08 AB18.AB1
  Bottom 0.254: v30.48,24.13 32.07,22.54 60.01,22.54 61.91,24.45 74.61,24.45 v90.49,40.32 | v90.49,77.79 91.44,78.74 91.44,80.96 60.64,80.96 59.37,82.23 46.67,82.23 40.01,88.9 v29.84,88.9
LINE_MUX_L
  Top 0.254: D18.V2 26.67,5.4 25.72,6.35 25.72,56.52 26.99,57.78 26.99,73.98 C18.V2
MBM_04_L
  Top 0.254: D19.L1 20.64,30.8 20.64,33.02 21.91,34.29 21.91,98.42 20.95,99.38 C19.L1
N$1
  Top 0.254: AB17.AU1 48.9,210.5 47.94,209.55 47.94,176.21 50.48,173.67 50.48,149.22 49.53,148.27 AB17.BS1
  Bottom 0.254: AB17.BR1 46.35,150.18 48.58,147.95 AB17.BS1
N$2
  Top 0.254: AB19.BD1 20.32,183.2 18.73,184.78 18.73,228.6 17.78,229.55 AB19.AM2
N$3
  Top 0.254: AB18.AV1 32.7,208.28 28.89,208.28 28.89,228.6 29.84,229.55 AB18.AM2
N$4
  Top 0.254: AB17.AV1 45.72,208.6 44.13,210.19 44.13,228.6 43.18,229.55 AB17.AM2
SKIP_BUS_L  (via drill 0.61)
  Top 0.254: v29.84,30.48 29.84,32.7 D18.K2 | v87.95,13.65 88.27,13.97 88.27,80.33 v86.68,81.91 | v45.09,86.04 44.77,86.36 44.77,99.38 | v44.13,100.01 44.77,99.38 | v52.39,138.11 52.39,242.57 47.94,247.01 47.94,256.54 46.35,258.13 AB17.AB1 | v50.48,136.21 46.04,131.76 46.04,127.32 44.77,126.05 44.77,99.38
  Bottom 0.254: v29.84,30.48 28.26,28.89 23.18,28.89 16.19,21.91 16.19,19.37 16.83,19.37 23.18,13.02 31.11,13.02 31.75,13.65 35.24,13.65 35.88,13.02 83.5,13.02 84.14,13.65 v87.95,13.65 | v86.68,81.91 85.72,82.87 48.26,82.87 v45.09,86.04 | v44.13,100.01 42.86,101.28 34.61,101.28 32.07,103.82 30.48,103.82 C18.K2 | v50.48,136.21 v52.39,138.11
VCC
  Top 0.762: A07.A2 157.8,261.62 161.93,261.62 161.93,197.17 157.48,192.72 B07.A2
  Bottom 0.762: 15.56,263.52 6.67,263.52 5.4,262.25 AB20.AA2 | 15.56,263.52 16.83,262.25 AB19.AA2 | 28.42,263.37 28.26,263.52 15.88,263.52 15.56,263.52 | 28.42,263.37 29.53,262.25 AB18.AA2 | 28.42,263.37 28.57,263.52 40.96,263.52 42.23,262.25 AB17.AA2 43.5,262.25 44.77,263.52 155.26,263.52 156.53,262.25 A07.A2 | 15.56,190.5 6.67,190.5 5.4,191.77 AB20.BA2 | 15.56,190.5 16.83,191.77 AB19.BA2 | 28.42,190.66 28.26,190.5 15.88,190.5 15.56,190.5 | 28.42,190.66 29.53,191.77 AB18.BA2 | 28.42,190.66 28.57,190.5 40.96,190.5 42.23,191.77 AB17.BA2 43.5,191.77 44.77,190.5 155.26,190.5 155.57,190.5 | 155.57,190.5 155.57,191.77 156.53,191.77 B07.A2 | 155.57,190.5 155.57,140.65 156.53,139.7 156.84,139.7 156.84,129.22 C07.A2